# Altium schematic sheet Seperation Switches.SchDoc: SEPERATION SWITCHES
size B; CompanyName: ENGINEERING & TECHNICAL SERVICES; DrawnBy: C. Kornowski; Engineer: C. Kornowski; Organization: TECHNOLOGY DEVELOPMENT & ENGINEERING CENTER; Address1: 11401 HOOVER ROAD; Address2: MILAN, OH  44846; DocumentNumber: RD17-7000; SheetNumber: 7; PageSetup: Record=PageOptions|CenterHorizontal=True|CenterVertical=True|PrintScale=1.09|XCorrection=1.00|YCorrection=1.00|PrintKind=1|BorderSize=5000000|LeftOffset=0|BottomOffset=0|Orientation=2|PaperLength=1000|PaperWidth=1000|Scale=100|PaperSource=7|PrintQuality=600|MediaType=1|DitherType=10|PaperKind=11x17|PrintScaleMode=1
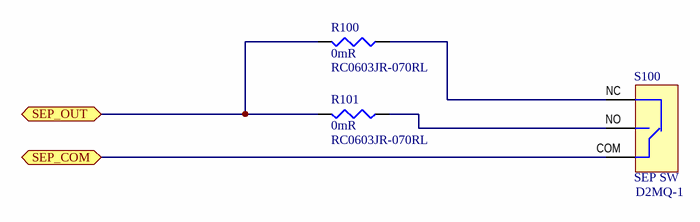
[diagram p0: Seperation Switches.SchDoc]

## Parts
R100  0mR  Manufacturer Part Number 1: RC0603JR-070RL  [0603]
R101  0mR  Manufacturer Part Number 1: RC0603JR-070RL  [0603]
S100  SEP SW  [D2MQ-1]

## Ports
SEP_COM (bidir), SEP_OUT (bidir)

## Nets
SEP_COM: S100.COM ; port SEP_COM
SEP_OUT: R100.2 R101.2 ; port SEP_OUT
NetR100_1: R100.1 S100.NC
NetR101_1: R101.1 S100.NO

## Notes on the sheet
- DCN
- REV
- DESCRIPTION
- REVISION HISTORY
- DATE
- APPROVED
- SIZE
- TITLE
- CAGE CODE
- DWG NO.
- DRAWN BY
- B
- 01HY9
- ENGINEER
- FILE NAME
- SHEET
- PRINTED:
- OF

## Library data of the parts
R100 R101 = RES1: RES SMD 0 OHM JUMPER 1/10W 0603; Manufacturer 1: Yageo; Tolerance: 1%; Voltage Rating: 50V; Power Rating: 100mW; Temperature Coefficient: 200ppm/°C; ComponentLink1URL: https://datasheet.ciiva.com/11808/pyu-r-int-6-11808700.pdf?src-supplier=RSComponents; ComponentLink1Description: https://datasheet.ciiva.com/11808/pyu-r-int-6-11808700.pdf?src-supplier=RSComponents; ComponentLink2URL: https://datasheet.ciiva.com/7746/1738695-7746421.pdf?src-supplier=Element14; ComponentLink2Description: https://datasheet.ciiva.com/7746/1738695-7746421.pdf?src-supplier=Element14; ComponentLink3URL: https://datasheet.ciiva.com/8883/pyu-rc0603-51-rohs-l-4-8883045.pdf?src-supplier=Avnet; ComponentLink3Description: https://datasheet.ciiva.com/8883/pyu-rc0603-51-rohs-l-4-8883045.pdf?src-supplier=Avnet; ComponentLink4URL: https://datasheet.ciiva.com/15189/getdatasheetpartid-329462-15189845.pdf?src-supplier=Verical; ComponentLink4Description: https://datasheet.ciiva.com/15189/getdatasheetpartid-329462-15189845.pdf?src-supplier=Verical; ComponentLink5URL: https://datasheet.ciiva.com/7746/1738695-7746422.pdf?src-supplier=Element14; ComponentLink5Description: https://datasheet.ciiva.com/7746/1738695-7746422.pdf?src-supplier=Element14; ComponentLink6URL: https://datasheet.ciiva.com/12555/rc0603-272842-12555254.pdf?src-supplier=Mouser; ComponentLink6Description: https://datasheet.ciiva.com/12555/rc0603-272842-12555254.pdf?src-supplier=Mouser; ComponentLink7URL: https://datasheet.ciiva.com/22747/443971-22747530.pdf?src-supplier=Element14; ComponentLink7Description: https://datasheet.ciiva.com/22747/443971-22747530.pdf?src-supplier=Element14; Supplier 1: Digi-Key; Supplier Part Number 1: 311-0.0GRCT-ND; Stock 1: 37679871; Pricing 1: 1=0.10000, 10=0.01800, 25=0.01320, 50=0.01000, 100=0.00730, 250=0.00560, 500=0.00448, 1000=0.00329 (USD); RoHS: Yes; Case/Package: 0603; Number of Pins: 2; Case Code (Imperial): 0603; Case Code (Metric): 1608; Contact Plating: Tin,Matte; Min Operating Temperature: -55°C; Max Operating Temperature: 155°C; Package Quantity: 5000; Value: 0mR; Packaging: Tape and Reel; Voltage Rating (DC): 50V; Termination: SMD/SMT; Composition: Thick Film; Military Standard: Not; Length: 1.6mm; Height: 0.45mm; Width: 0.8mm; Depth: 0.8mm; Radiation Hardening: No; REACH SVHC: No SVHC; Lead Free: Lead Free
S100 = D2MQ-1: Basic / Snap Action Switches PIN PLUNGER AG-P; Manufacturer: Omron; Actuator Material: Plastic; Mechanical Life: 30000Cycles; Insulation Resistance: 100MR; Switch Function: On-Mom; Max Voltage Rating (DC): 30V; Max Current Rating: 500mA; Pretravel: 0.015inch; Differential Travel: 0.004inch; Operating Position: 0.224inch; Electrical Life: 10000Cycles; Throw Configuration: SPDT; Operating Force: 1.18N; Ratings: IP40; Supplier 1: Digi-Key; Supplier Part Number 1: SW145-ND; Manufacturer Part Number: D2MQ-1; RoHS: Yes; Category: Snap Action / Limit Switches; Pricing 1: 1=3.02000, 10=2.79100, 25=2.61680, 50=2.55860, 100=2.03520, 250=1.91888, 500=1.81712 (USD); Mount: Through Hole,Panel,Screw; Weight: 0.3g; Contact Plating: Silver; Contact Material: Silver; Min Operating Temperature: -15°C; Max Operating Temperature: 70°C; Package Quantity: 1000; Current Rating: 500mA; Orientation: Straight; Overtravel: 0.004inch; Termination: PC Pins; Packaging: Tray; Voltage Rating (DC): 30V; Contact Current Rating: 500mA; Length: 8.2mm; Depth: 2.7mm; Radiation Hardening: No; Lead Free: Lead Free; REACH SVHC: Unknown; ComponentLink1URL: https://datasheet.ciiva.com/14143/03587136-14143409.pdf?src-supplier=Distrelec; ComponentLink1Description: https://datasheet.ciiva.com/14143/03587136-14143409.pdf?src-supplier=Distrelec; ComponentLink2URL: https://datasheet.ciiva.com/30245/en-d2mq-30245222.pdf?src-supplier=Onlinecomponents.com; ComponentLink2Description: https://datasheet.ciiva.com/30245/en-d2mq-30245222.pdf?src-supplier=Onlinecomponents.com; ComponentLink3URL: https://datasheet.ciiva.com/2890/en-d2mq-2890972.pdf?src-supplier=Digi-Key; ComponentLink3Description: https://datasheet.ciiva.com/2890/en-d2mq-2890972.pdf?src-supplier=Digi-Key